# EAGLE design Un_Battery_old (EAGLE 6.2)
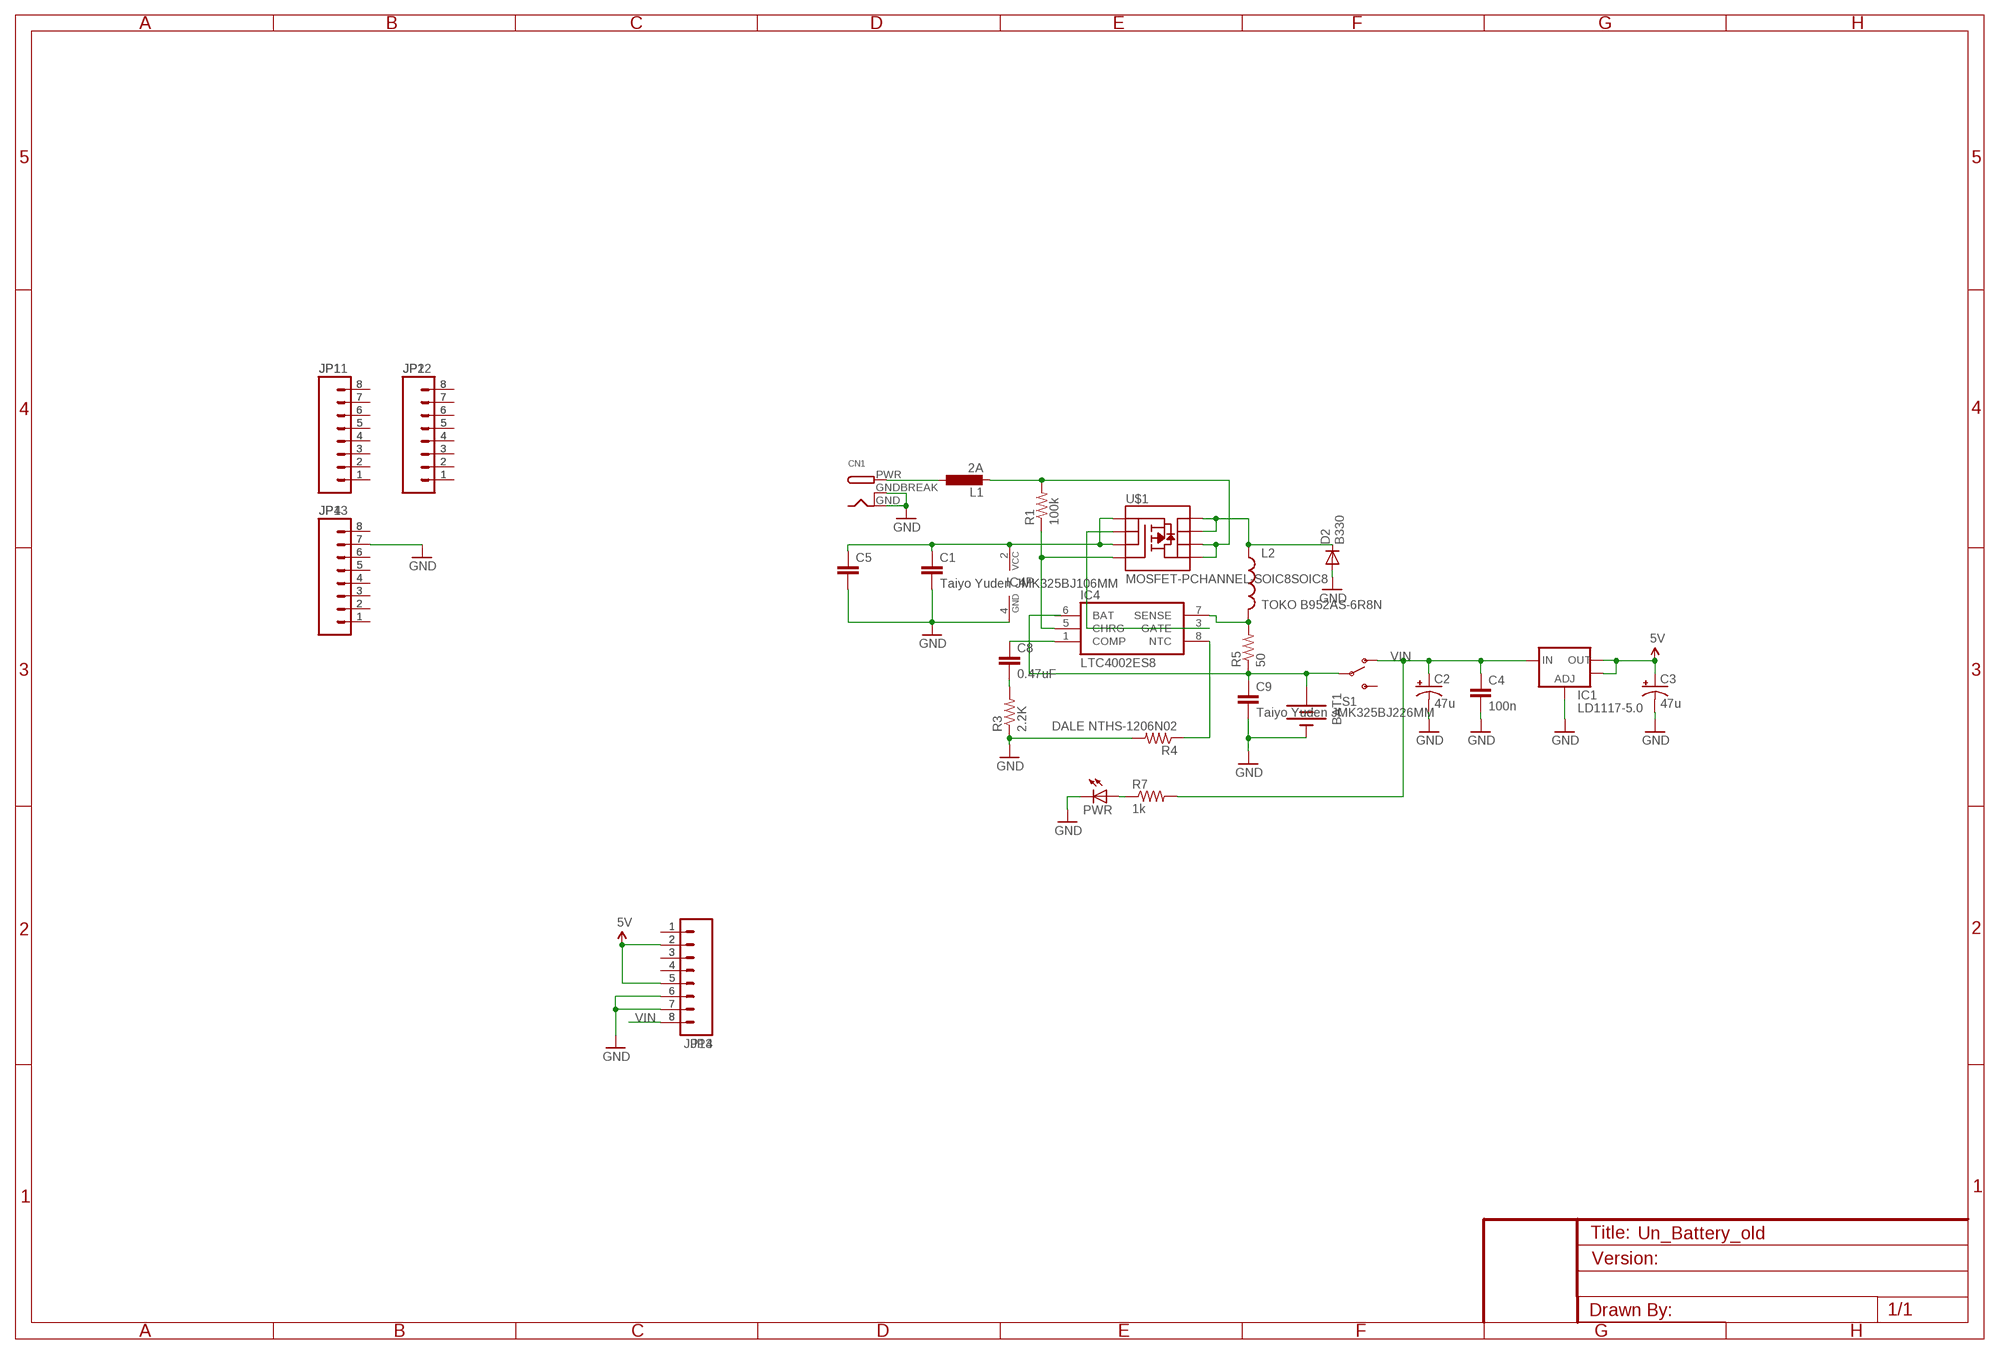
[diagram p0: schematic, sheet 1]

## Parts
BAT1  BATTERYLIPO  [BATTERY-LIPO]
C1  Taiyo Yuden JMK325BJ106MM  CAP1206  [1206]
C2  47u  CAP_POLD  [PANASONIC_D]
C3  47u  CAP_POLD  [PANASONIC_D]
C4  100n  CAP0603-CAP  [0603-CAP]
C5  CAP1206  [1206]
C8  0.47uF  CAP1206  [1206]
C9  Taiyo Yuden JMK325BJ226MM  CAP1206  [1206]
CN1  DCBARRELPTH  [DCJACK_2MM_PTH]
D2  B330  DIODESMA  [SMA-DIODE]
IC1  LD1117-5.0  V_REG_LM1117SOT223  [SOT223]
IC4  LTC4002ES8  [SO08]
JP1  M08SMD  [1X08-SMD]
JP2  M08SMD  [1X08-SMD]
JP3  M08SMD  [1X08-SMD]
JP4  M08SMD  [1X08-SMD]
JP11  M08SMD  [1X08-SMD]
JP12  M08SMD  [1X08-SMD]
JP13  M08SMD  [1X08-SMD]
JP14  M08SMD  [1X08-SMD]
L1  2A  L-EUL1812  [L1812]
L2  TOKO B952AS-6R8N  INDUCTORCR75  [CR75]
PWR  LED0805  [LED-0805]
R1  100k  RESISTOR1206  [1206]
R3  2.2K  RESISTOR1206  [1206]
R4  DALE NTHS-1206N02  RESISTOR1206  [1206]
R5  50  RESISTOR1206  [1206]
R7  1k  RESISTOR0805-RES  [0805]
S1  SWITCH-SPSTSMD2  [SWITCH-SPDT-SMD]
U$1  MOSFET-PCHANNEL-SOIC8SOIC8  [SO08]

## Nets
5V: C3.+ IC1.2(OUT) IC1.4(OUT) JP3.2 JP3.5 JP14.2 JP14.5
9V: L1.2 R1.2 U$1.5(D) U$1.6(D)
GND: BAT1.- C1.2 C2.- C3.- C4.2 C5.2 C9.2 CN1.GND CN1.GNDBREAK D2.A IC1.1(ADJ) IC4.4(GND) JP3.6 JP3.7 JP4.7 JP13.7 JP14.6 JP14.7 PWR.2(C) R3.1 R4.2
N$1: JP1.1 JP11.1
N$2: JP1.2 JP11.2
N$3: JP1.3 JP11.3
N$4: CN1.PWR L1.1
N$5: JP1.4 JP11.4
N$6: JP1.5 JP11.5
N$7: IC4.3(GATE) U$1.2(S)
N$8: C8.2 R3.2
N$9: IC4.5(CHRG) R1.1 U$1.4(G)
N$10: C1.1 C5.1 IC4.2(VCC) U$1.1(S) U$1.3(S)
N$11: C8.1 IC4.1(COMP)
N$12: JP1.6 JP11.6
N$13: JP1.7 JP11.7
N$14: PWR.1(A) R7.1
N$15: IC4.8(NTC) R4.1
N$16: JP1.8 JP11.8
N$17: JP2.1 JP12.1
N$18: JP2.2 JP12.2
N$20: IC4.7(SENSE) L2.P$2 R5.2
N$21: BAT1.+ C9.1 R5.1 S1.2(P)
N$22: JP2.3 JP12.3
N$23: JP2.4 JP12.4
N$24: JP2.5 JP12.5
N$25: JP2.6 JP12.6
N$26: JP2.7 JP12.7
N$27: JP2.8 JP12.8
N$28: JP3.1 JP14.1
N$30: JP3.3 JP14.3
N$31: JP3.4 JP14.4
N$32: D2.C L2.P$1 U$1.7(D) U$1.8(D)
N$36: JP4.1 JP13.1
N$37: JP4.2 JP13.2
N$38: JP4.3 JP13.3
N$39: JP4.4 JP13.4
N$40: JP4.5 JP13.5
N$41: JP4.6 JP13.6
N$43: JP4.8 JP13.8
VIN: C2.+ C4.1 IC1.3(IN) JP3.8 JP14.8 R7.2 S1.1(O)
Unconnected: IC4.6(BAT) S1.3(S)

## Library data of the parts
BAT1 = 2SparkFun:BATTERY: Battery Holders Various common sizes : AA, AAA, 20mm coin cell and 12mm coin cell.
C1 C5 C8 C9 = 2SparkFun:CAP: Capacitor Standard 0603 ceramic capacitor, and 0.1" leaded capacitor.
C2 C3 = 1SparkFun:CAP_POL: Capacitor Polarized These are standard SMD and PTH capacitors. Normally 10uF, 47uF, and 100uF in electrolytic and tantalum varieties. Always verify the external diameter of the through hole cap, it varies with capacity, voltage, and manufacturer. The EIA devices should be standard.
C4 = 1SparkFun:CAP: Capacitor Standard 0603 ceramic capacitor, and 0.1" leaded capacitor.
CN1 = 1adafruit:DCBARREL: 2.0mm DC Barrel Jack DCJACK_2MM_PTH - Through Hole Jack (4UConnector: 05537)
D2 = 2SparkFun:DIODE: Diode These are standard reverse protection diodes and small signal diodes. SMA package can handle up to about 1A. SOD-323 can handle about 200mA. What the SOD-323 package when ordering, there are some mfgs out there that are 5-pin packages.
IC1 = 1SparkFun:V_REG_LM1117: Voltage Regulator LM1117 Standard adjustable voltage regulator but in SMD form. Spark Fun Electronics SKU : COM-00595
IC4 = linear-technology-3:LTC4002*: Standalone Li-Ion Switch Mode Battery Charger
JP1-JP4 JP11-JP14 = 2SparkFun:M08: Header 8 Standard 8-pin 0.1" header. Use with straight break away headers (SKU : PRT-00116), right angle break away headers (PRT-00553), swiss pins (PRT-00743), machine pins (PRT-00117), and female headers (PRT-00115).
L1 = rcl:L-EU: INDUCTOR, European symbol
L2 = 2SparkFun:INDUCTOR: Inductors Basic Inductor/Choke - 0603 and 1206. Footprints are not proven and vary greatly between part numbers.
PWR = 1SparkFun:LED: LEDs Standard schematic elements and footprints for 5mm, 3mm, 1206, and 0603 sized LEDs. 5mm - Spark Fun Electronics SKU : COM-00529 (and others)
R1 R3-R5 R7 = 2SparkFun:RESISTOR: Resistor Basic schematic elements and footprints for 0603, 1206, and PTH resistors.
S1 = 2SparkFun:SWITCH-SPST: SPST Switch Simple slide switch. Spark Fun Electronics SKU : COM-00102
U$1 = 2SparkFun:MOSFET-PCHANNEL-SOIC8

## Net classes
0 default: width 0.254 mm, clearance 0.254 mm
1 power: width 0.61 mm, drill 0.61 mm, clearance 0.254 mm
2 gnd: width 0.305 mm, drill 0.559 mm, clearance 0.254 mm
3 usbvcc: width 0.508 mm, drill 0.61 mm, clearance 0.254 mm
4 aref: width 0.406 mm, drill 0.61 mm, clearance 0.254 mm

## Board
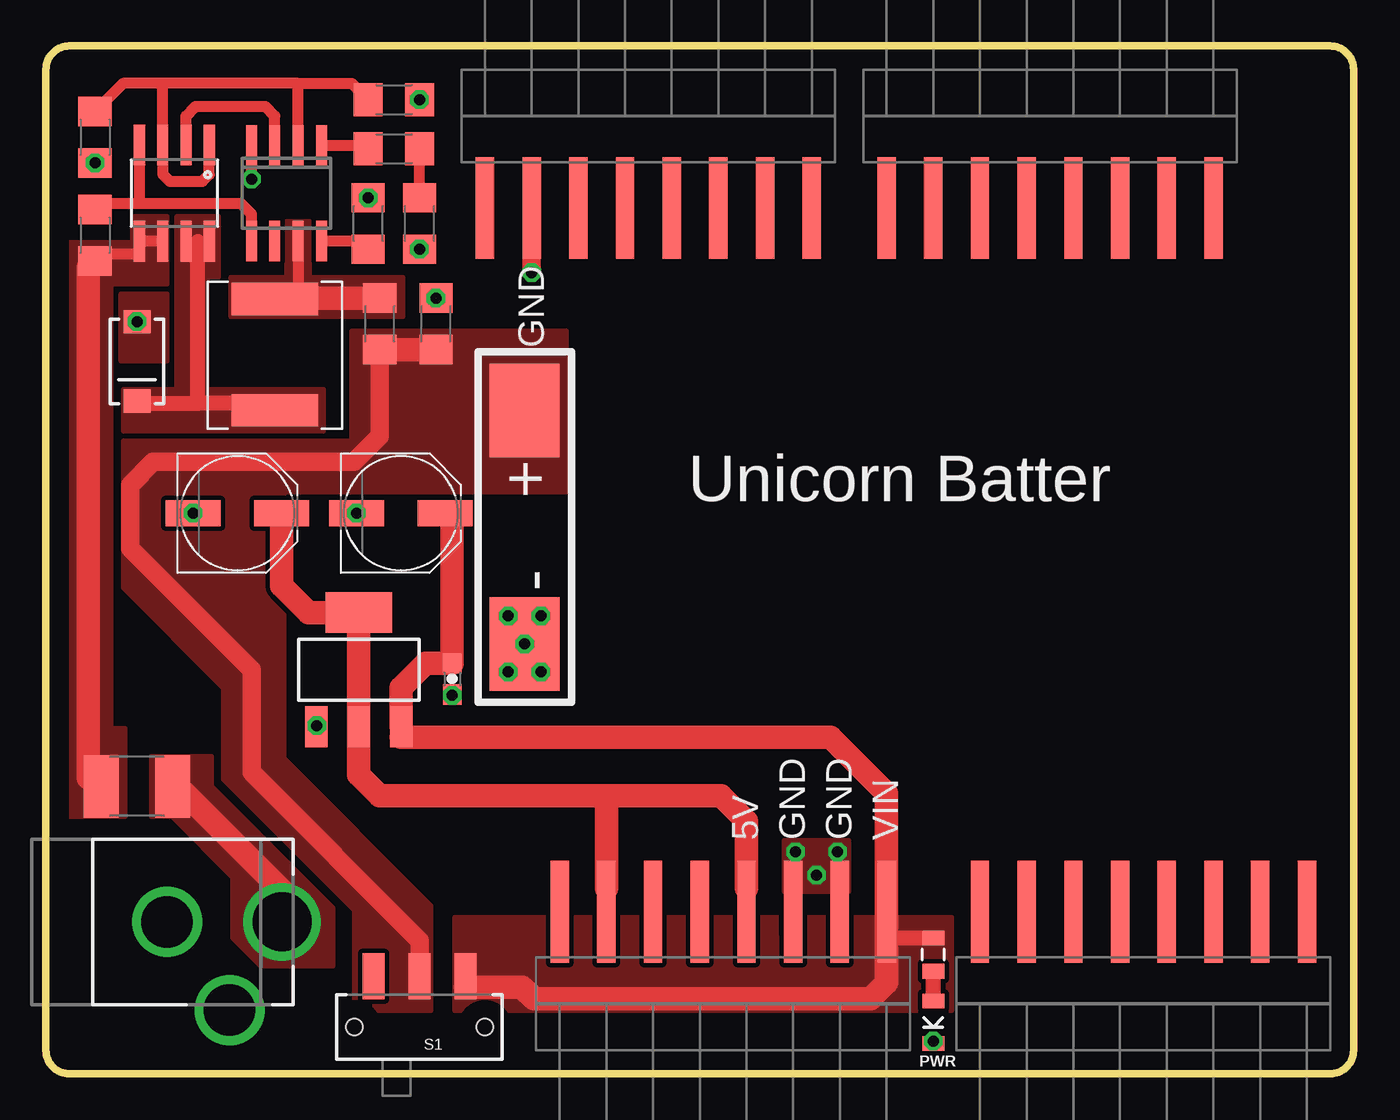
[diagram p1: board, top side]
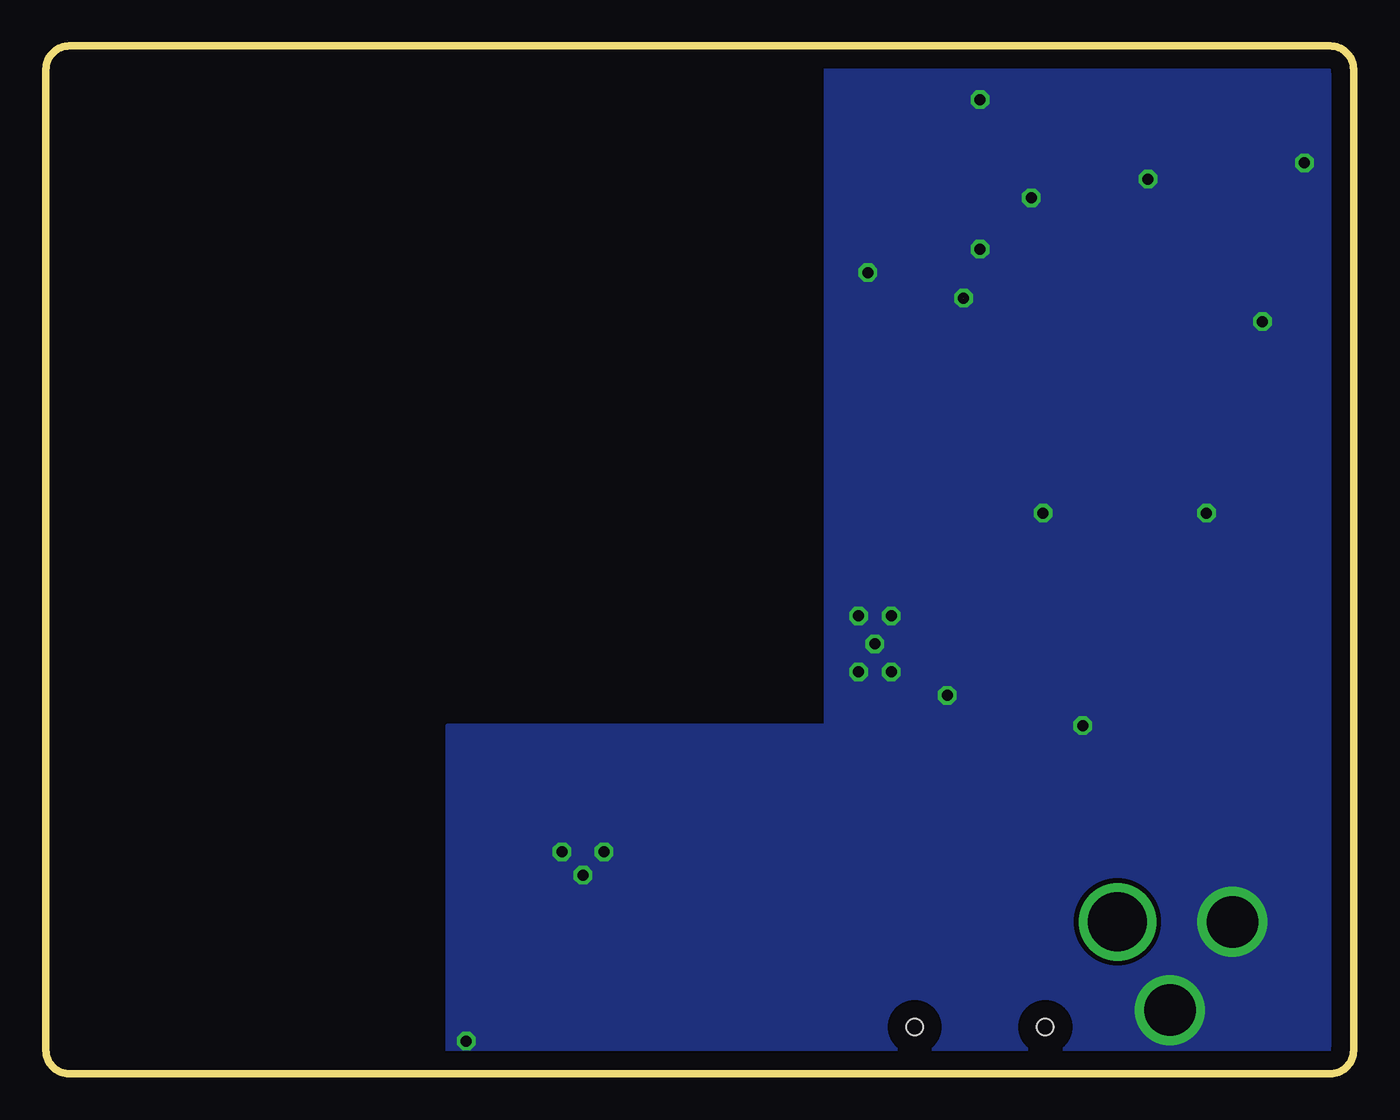
[diagram p2: board, bottom side, seen from below]

Size 71.12 x 55.88 mm. Coordinates in mm from the lower left corner, seen from the top.
Outline: 1.27,0 69.85,0 arc90 71.12,1.27 71.12,54.61 arc90 69.85,55.88 1.27,55.88 arc90 0,54.61 0,1.27 arc90 1.27,0
Copper layers (1*16): Top 0.035mm / dielectric 1.5mm / Bottom 0.035mm
Design rules "default": minimum track width 10mil, minimum drill 24mil, track to track 10mil, track to pad 10mil, pad to pad 10mil, via to via 10mil, smd to smd 10mil, copper to edge 40mil, drill to drill 8mil, minimum pad ring 10mil, minimum via ring 8mil, stop-mask expansion 4mil, vias tented up to drill 0mil, thermal gap 10mil

### Footprints (pad centres in the part's own frame; a part is rotated, then mirrored left to right if it is on the bottom)
BATTERY-LIPO = smd 5.08 x 3.81: + -6.35,0; - 6.35,0
1206 = smd 1.6 x 1.8: 1 -1.4,0; 2 1.4,0
PANASONIC_D = smd 3 x 1.4: + 2.4,0; - -2.4,0
0603-CAP = smd 1.1 x 1: 1 -0.85,0; 2 0.85,0
DCJACK_2MM_PTH = drill 2.8: GND 0,7.35; GNDBREAK 4.8,10.75 | drill 3.2: PWR 0,13.6
SMA-DIODE = smd 1.27 x 1.47: A -2.15,0; C 2.15,0
SOT223 = smd 1.219 x 2.235: 1 -2.311,-3.099; 2 0,-3.099; 3 2.311,-3.099 | smd 3.6 x 2.2: 4 0,3.099
SO08 = smd 0.6 x 2.2: 1 -1.905,-2.6; 2 -0.635,-2.6; 3 0.635,-2.6; 4 1.905,-2.6; 5 1.905,2.6; 6 0.635,2.6; 7 -0.635,2.6; 8 -1.905,2.6
1X08-SMD = smd 1 x 3: 1 -8.89,5; 2 -6.35,5; 3 -3.81,5; 4 -1.27,5; 5 1.27,5; 6 3.81,5; 7 6.35,5; 8 8.89,5
L1812 = smd 1.9 x 3.4: 1 -1.95,0; 2 1.95,0
CR75 = smd 1.75 x 4.7: P$1 0,0; P$2 6.05,0
LED-0805 = smd 0.8 x 1.2: 1 -1.154,0; 2 1.154,0
0805 = smd 0.8 x 1.2: 1 -0.9,0; 2 0.9,0
SWITCH-SPDT-SMD = smd 1.2 x 2.5: 1 -2.5,-2.75; 2 0,-2.75; 3 2.5,-2.75 | hole 0.9: -3.55,0; 3.55,0
SO08' = smd 0.61 x 2.21: 1 -1.905,-2.616; 2 -0.635,-2.616; 3 0.635,-2.616; 4 1.905,-2.616; 5 1.905,2.616; 6 0.635,2.616; 7 -0.635,2.616; 8 -1.905,2.616

### Placement (x,y rotation side)
BAT1  26.03,29.72 270 top
C1  2.67,50.93 270 top
C2  19.3,30.48 0 top
C3  10.41,30.48 0 top
C4  22.1,21.46 270 top
C5  18.92,52.96 0 top
C8  18.92,50.29 0 top
C9  21.21,40.77 90 top
CN1  -0.76,8.26 270 top
D2  4.95,38.73 270 top
IC1  17.02,21.97 0 top
IC4  13.08,47.88 180 top
JP1  59.69,5.08 0 top
JP2  54.61,50.8 180 top
JP3  36.83,5.08 0 top
JP4  32.77,50.8 180 top
JP11  59.69,2.54 0 top
JP12  54.61,53.34 180 top
JP13  32.77,53.34 180 top
JP14  36.83,2.54 0 top
L1  4.95,15.62 180 top
L2  12.45,36.07 90 top
PWR  48.26,2.79 270 top
R1  2.67,45.59 270 top
R3  20.32,46.23 90 top
R4  17.53,46.23 90 top
R5  18.16,40.77 90 top
R7  48.26,6.48 90 top
S1  20.32,2.54 180 top
U$1  MOSFET-PCHANNEL-SOIC8SOIC8  [SO08']  6.98,47.88 180 top

### Tracks (layer width: path | path; a pad name or v marks a point on that pad's centre or on a via)
5V
  Top 0.813: 38.1,9.02 JP14.5 JP3.5 | JP3.2 JP14.2
  Top 1.016: 12.83,30.47 C3.+
  Top 1.27: JP3.5 38.1,13.72 36.7,15.11 30.48,15.11 | JP3.2 30.48,15.11 | 12.83,30.47 12.83,26.54 14.3,25.07 IC1.4 IC1.2 17.02,16.26 18.16,15.11 30.48,15.11
9V
  Top 0.61: U$1.6 U$1.5 5.08,44.58 3.05,44.58 R1.2
  Top 1.27: 2.29,16.09 2.29,43.81 R1.2
  pour Top (no thermals): 3.56,18.8 3.56,42.93 6.6,42.93 6.6,46.61 4.7,46.61 4.7,45.21 0.76,45.21 0.76,13.97 4.32,13.97 4.32,18.8
GND  (via drill 0.6)  (1 unrouted)
  Top 0.254: R3.1 | v17.53,47.62 R4.2 | C3.- v8,30.48 | C2.- v16.89,30.48 | v14.73,18.92 14.73,18.9 IC1.1 | C4.2 v22.1,20.57 | C1.2 | C5.2
  Top 0.61: v11.18,48.64 IC4.4 | v4.95,40.89 D2.A | PWR.2 v48.26,1.78
  Top 1.016: v26.42,43.56 JP4.7 JP13.7 | 43.18,11.05 JP3.7 JP14.7 | JP14.6 JP3.6 40.64,11.05
  other vias: 2.67,49.53 20.32,52.96 26.03,23.37 43.05,12.06 20.32,44.83 21.21,42.16 25.15,24.89 26.92,24.89 25.15,21.84 26.92,21.84 41.91,10.79 40.77,12.06
  pour Bottom (no thermals): 0,55.88 28.7,55.88 28.7,18.92 49.28,18.92 49.28,0 0,0
  pour Top (no thermals): 4.06,42.42 6.6,42.42 6.6,38.73 4.06,38.73
  pour Top (no thermals): 40.13,9.91 43.69,9.91 43.69,12.7 40.13,12.7
N$1
  Top 0.813: JP1.1 JP11.1
N$2
  Top 0.813: JP1.2 JP11.2
N$3
  Top 0.813: JP1.3 JP11.3
N$4
  Top 1.27: CN1.PWR 12.84,9.94 7.15,15.62 L1.1
  pour Top (no thermals): 5.72,17.27 9.02,17.27 9.02,15.62 15.62,9.02 15.62,5.84 11.68,5.84 10.16,7.37 10.16,10.67 6.86,13.97 5.72,13.97
N$5
  Top 0.813: JP1.4 JP11.4
N$6
  Top 0.813: JP1.5 JP11.5
N$7
  Top 0.61: U$1.2 7.62,52.07 8.13,52.58 11.94,52.58 12.45,52.07 IC4.3
N$8
  Top 0.61: R3.2 C8.2
N$9
  Top 0.61: IC4.5 11.18,46.74 10.59,47.32 5.21,47.32 | 5.21,47.32 2.99,47.32 R1.1 | U$1.4 5.08,47.45 5.21,47.32
N$10
  Top 0.61: IC4.2 13.72,53.85 | 13.72,53.85 6.35,53.85 | 6.35,53.85 4.19,53.85 C1.1 | 6.35,53.85 U$1.3 6.35,48.9 6.73,48.51 8.51,48.51 8.89,48.9 U$1.1 | 17.08,52.77 C5.1 16.63,53.85 13.72,53.85
N$11
  Top 0.61: IC4.1 17.84,50.48 C8.1
N$12
  Top 0.813: JP1.6 JP11.6
N$13
  Top 0.813: JP1.7 JP11.7
N$14
  Top 0.813: PWR.1 R7.1
N$15
  Top 0.61: IC4.8 17.71,45.28 R4.1
N$16
  Top 0.813: JP1.8 JP11.8
N$17
  Top 0.813: JP2.1 JP12.1
N$18
  Top 0.813: JP2.2 JP12.2
N$20
  Top 0.61: IC4.7 13.72,42.29 13.59,42.16 12.95,42.16 12.24,42.16 L2.P$2
  Top 1.27: R5.2 12.95,42.17 12.95,42.16
  pour Top (no thermals): 10.03,41.15 19.43,41.15 19.43,43.31 14.35,43.31 14.35,46.35 13.08,46.35 13.08,43.31 10.03,43.31
N$21
  Top 1.016: S1.2 20.32,7.24 11.18,16.38 11.18,21.97 4.57,28.57 4.57,32 5.84,33.27 16.76,33.27 18.16,34.67 18.16,35.69 18.16,36.2 R5.1
  Top 1.27: R5.1 C9.1
  pour Top (no thermals): 16.64,40.39 28.32,40.39 28.32,31.62 12.95,31.62 12.95,17.14 20.95,9.14 20.95,3.43 16.76,3.43 16.76,8.89 9.65,16 9.65,20.95 4.19,26.42 4.19,34.42 16.64,34.42
N$22
  Top 0.813: JP2.3 JP12.3
N$23
  Top 0.813: JP2.4 JP12.4
N$24
  Top 0.813: JP2.5 JP12.5
N$25
  Top 0.813: JP2.6 JP12.6
N$26
  Top 0.813: JP2.7 JP12.7
N$27
  Top 0.813: JP2.8 JP12.8
N$28
  Top 0.813: JP3.1 JP14.1
N$30
  Top 0.813: JP3.3 JP14.3
N$31
  Top 0.813: JP3.4 JP14.4
N$32
  Top 0.254: U$1.7 8.25,45.26
  Top 0.61: 8.25,45.26 U$1.8
  Top 0.813: L2.P$1 12.06,36.45 8.25,36.45 | D2.C 5.09,36.45 8.25,36.45 | 8.25,36.45 8.25,45.26
  pour Top (no thermals): 4.19,34.92 15.11,34.92 15.11,37.21 8.76,37.21 8.76,43.31 9.4,43.31 9.4,46.61 7.11,46.61 7.11,37.21 4.19,37.21
N$36
  Top 0.813: JP4.1 JP13.1
N$37
  Top 0.813: JP4.2 JP13.2
N$38
  Top 0.813: JP4.3 JP13.3
N$39
  Top 0.813: JP4.4 JP13.4
N$40
  Top 0.813: JP4.5 JP13.5
N$41
  Top 0.813: JP4.6 JP13.6
N$43
  Top 0.813: JP4.8 JP13.8
VIN
  Top 0.813: R7.2 45.88,7.38 JP14.8
  Top 1.016: S1.1 22.82,4.7 | 22.1,30.09 C2.+ | IC1.3 19.33,18.29
  Top 1.27: 22.82,4.7 25.91,4.7 26.54,4.06 44.83,4.06 45.72,4.95 JP14.8 JP3.8 45.72,15.24 42.67,18.29 19.33,18.29 | 22.1,30.09 C4.1 20.66,22.31 19.33,20.98 IC1.3
  pour Top (no thermals): 22.22,8.51 22.22,3.43 49.28,3.43 49.28,8.51

### Text on the board
tPlace: Unicorn Batter
tNames: GND | 5V | GND | GND | VIN | PWR